# Altium schematic sheet Main.SchDoc
size A4
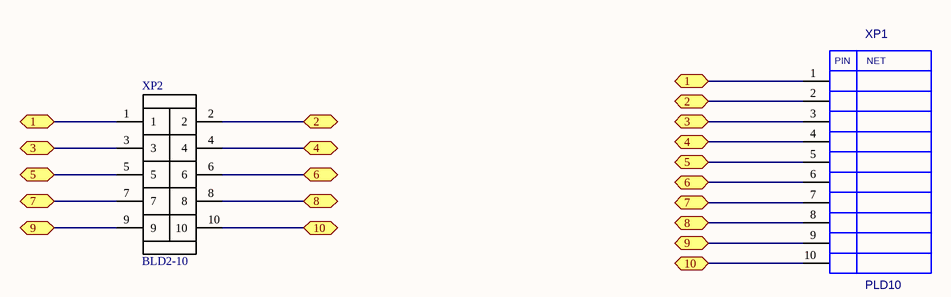
[diagram p0: Main.SchDoc]

## Parts
XP1  PLD10  [PIN10M]
XP2  BLD2-10  [PLD2-10]

## Ports
1 (bidir), 2 (bidir), 3 (bidir), 4 (bidir), 5 (bidir), 6 (bidir), 7 (bidir), 8 (bidir), 9 (bidir), 10 (bidir)

## Nets
1: XP1.1 XP2.1 ; port 1
2: XP1.2 XP2.2 ; port 2
3: XP1.3 XP2.3 ; port 3
4: XP1.4 XP2.4 ; port 4
5: XP1.5 XP2.5 ; port 5
6: XP1.6 XP2.6 ; port 6
7: XP1.7 XP2.7 ; port 7
8: XP1.8 XP2.8 ; port 8
9: XP1.9 XP2.9 ; port 9
10: XP1.10 XP2.10 ; port 10

## Notes on the sheet
- (in symbol PLD10) PIN; NET

## Library data of the parts
XP2 = PLD2-10: Value: BLD2-10
XP1 = PLD10: Value: *